# EAGLE design RFM69-ESP-03-v1.0 (EAGLE 7.7.0)
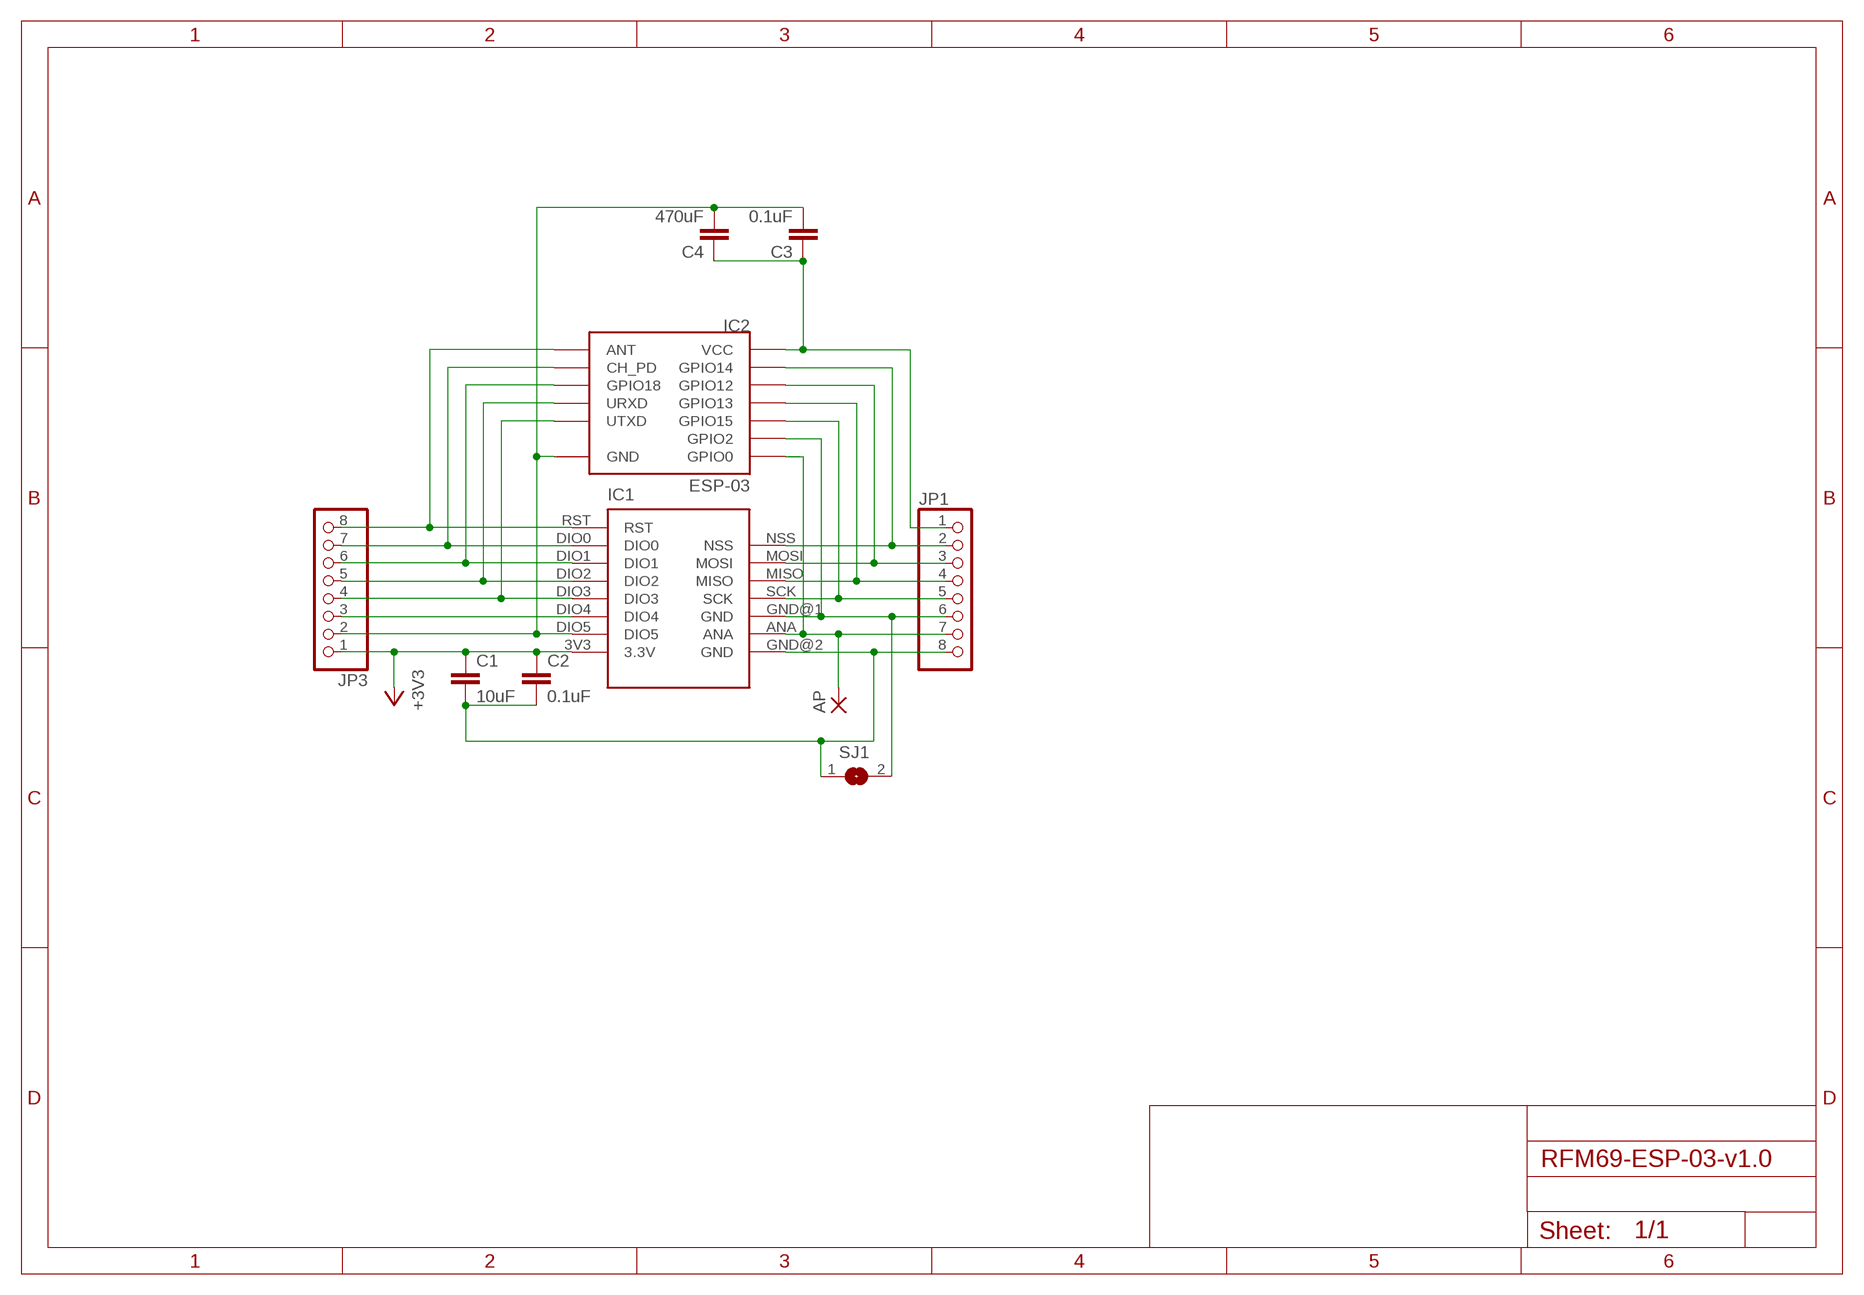
[diagram p0: schematic, sheet 1]

## Parts
AP  SMD5  [SMD2,54-5,08]
C1  10uF  C-EUC1206  [C1206]
C2  0.1uF  C-EUC1206  [C1206]
C3  0.1uF  C-EUC1206  [C1206]
C4  470uF  C-EUC1206  [C1206]
IC1  RFM69HW  [RFM69]
IC2  ESP-03  [ESP-03]
JP1  PINHD-1X8  [1X08]
JP3  PINHD-1X8  [1X08]
SJ1  SJ  [SJ]

## Nets
+3V3: C1.1 C2.1 IC1.3V3(3.3V) JP3.1
N$1: IC1.NSS IC2.GPIO14 JP1.2
N$2: IC1.MOSI IC2.GPIO12 JP1.3
N$3: IC1.MISO IC2.GPIO13 JP1.4
N$4: IC1.SCK IC2.GPIO15 JP1.5
N$5: AP.1(P) IC1.ANA IC2.GPIO0 JP1.7
N$6: C3.1 C4.1 IC2.VCC JP1.1
N$7: IC1.GND@1(GND) IC2.GPIO2 JP1.6 SJ1.2
N$8: IC1.RST IC2.ANT JP3.8
N$9: IC1.DIO0 IC2.CH_PD JP3.7
N$10: IC1.DIO1 IC2.GPIO18 JP3.6
N$11: IC1.DIO2 IC2.URXD JP3.5
N$12: IC1.DIO3 IC2.UTXD JP3.4
N$13: IC1.DIO4 JP3.3
N$15: C1.2 C2.2 IC1.GND@2(GND) JP1.8 SJ1.1
N$16: C3.2 C4.2 IC1.DIO5 IC2.GND JP3.2

## Library data of the parts
AP = wirepad:SMD5: SMD PAD
C1-C4 = rcl:C-EU: CAPACITOR, European symbol
IC1 = kiall:RFM69: RFM69 module
IC2 = kiall:ESP-03: ESP8266 Wifi module ESP-03
JP1 JP3 = pinhead:PINHD-1X8: PIN HEADER
SJ1 = jumper:SJ: SMD solder JUMPER

## Net classes
0 default: width 0.61 mm

## Board
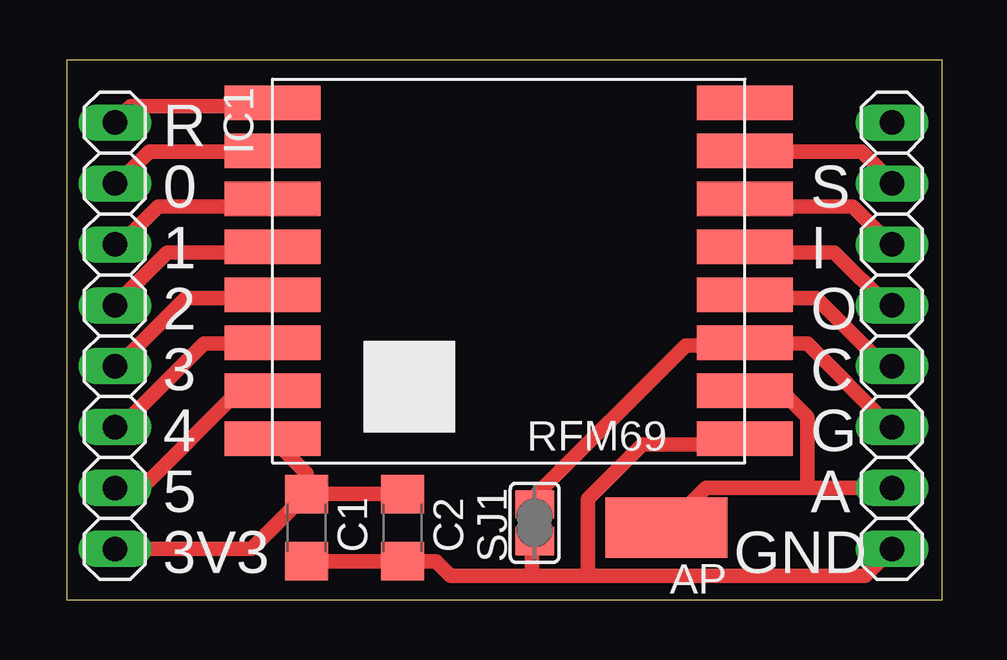
[diagram p1: board, top side]
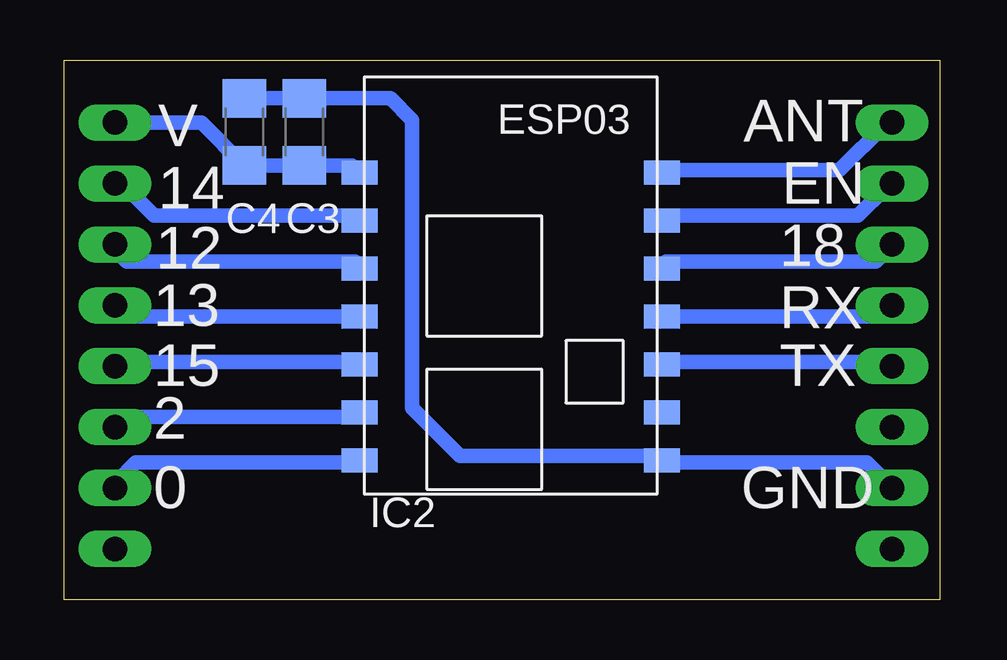
[diagram p2: board, bottom side, seen from below]

Size 36.5 x 22.5 mm. Coordinates in mm from the lower left corner, seen from the top.
Outline: 0,0 36.5,0 36.5,22.5 0,22.5 0,0
Copper layers (1*16): Top 0.035mm / dielectric 1.5mm / Bottom 0.035mm
Design rules "SeeedStudio_2layer_DRU_no_angle_20140221": minimum track width 6mil, minimum drill 12mil, track to track 6mil, track to pad 6mil, pad to pad 6mil, via to via 6mil, smd to smd 0mil, copper to edge 10mil, drill to drill 10mil, minimum pad ring 10mil, minimum via ring 6mil, stop-mask expansion 2mil, vias tented up to drill 100mil, thermal gap 10mil

### Footprints (pad centres in the part's own frame; a part is rotated, then mirrored left to right if it is on the bottom)
SMD2,54-5,08 = smd 2.54 x 5.08: 1 0,0
C1206 = smd 1.6 x 1.8: 1 -1.4,0; 2 1.4,0
RFM69 = smd 4 x 1.44: 3V3 0,1; ANA 19.7,3; DIO0 0,13; DIO1 0,11; DIO2 0,9; DIO3 0,7; DIO4 0,5; DIO5 0,3; GND@1 19.7,5; GND@2 19.7,1; MISO 19.7,9; MOSI 19.7,11; NC 19.7,15; NSS 19.7,13; RST 0,15; SCK 19.7,7
ESP-03 = smd 1.5 x 1: ANT 7.4,4.8; CH_PD 7.4,2.8; GND 7.4,-7.2; GPIO0 -5.2,-7.2; GPIO2 -5.2,-5.2; GPIO12 -5.2,0.8; GPIO13 -5.2,-1.2; GPIO14 -5.2,2.8; GPIO15 -5.2,-3.2; GPIO18 7.4,0.8; NC 7.4,-5.2; URXD 7.4,-1.2; UTXD 7.4,-3.2; VCC -5.2,4.8
1X08 = drill 1.016 long: 1 -8.89,0; 2 -6.35,0; 3 -3.81,0; 4 -1.27,0; 5 1.27,0; 6 3.81,0; 7 6.35,0; 8 8.89,0
SJ = smd 1.168 x 1.6: 1 -0.762,0; 2 0.762,0

### Placement (x,y rotation side)
AP  25,3 90 top
C1  10,3 270 top
C2  14,3 270 top
C3  26.5,19.5 90 bottom
C4  29,19.5 90 bottom
IC1  8.57,5.7 0 top
IC2  19,13 0 bottom
JP1  34.4,11 270 top
JP3  2,11 90 top
SJ1  19.5,3.2 90 top

### Tracks (layer width: path | path; a pad name or v marks a point on that pad's centre or on a via)
+3V3
  Top 0.61: JP3.1 7.71,2.11 C1.1 | C1.1 10,5.27 IC1.3V3 | C2.1 C1.1
N$1
  Top 0.61: IC1.NSS 28.57,18.67 33.15,18.67 34.29,17.53 JP1.2
  Bottom 0.61: IC2.GPIO14 24.38,16 32.77,16 34.29,17.53 JP1.2
N$2
  Top 0.61: IC1.MOSI 28.57,16.38 32.77,16.38 34.29,14.86 JP1.3
  Bottom 0.61: IC2.GPIO12 24.38,14.1 33.91,14.1 34.29,14.48 JP1.3
N$3
  Top 0.61: IC1.MISO 28.57,14.48 32,14.48 34.29,12.19 JP1.4
  Bottom 0.61: IC2.GPIO13 24.38,11.81 33.91,11.81 34.29,12.19 JP1.4
N$4
  Top 0.61: IC1.SCK 28.57,12.57 31.24,12.57 34.29,9.53 JP1.5
  Bottom 0.61: IC2.GPIO15 24.38,9.91 34.29,9.91 JP1.5
N$5
  Top 0.61: JP1.7 30.86,4.65 | 30.86,4.65 30.86,7.62 30.1,8.38 28.57,8.38 IC1.ANA | 30.86,4.65 26.65,4.65 AP.1
  Bottom 0.61: IC2.GPIO0 24.38,5.71 33.53,5.71 34.29,4.95 JP1.7
N$6
  Bottom 0.61: JP1.1 30.79,19.89 C4.1 26.67,18.1 | 26.67,18.1 C3.1 | C3.1 24.5,18.1 IC2.VCC | C3.1 26.67,18.29 26.67,18.1
N$7
  Top 0.61: JP1.6 34.29,7.24 30.86,10.67 28.57,10.67 IC1.GND@1 28.17,10.6 25.8,10.6 19.5,4.3 SJ1.2
  Bottom 0.61: IC2.GPIO2 24.38,7.62 33.91,7.62 34.29,7.24 JP1.6
N$8
  Top 0.61: IC1.RST 8.38,20.57 2.67,20.57 2.29,20.19 JP3.8
  Bottom 0.61: IC2.ANT 11.43,17.91 4.19,17.91 2.29,19.81 JP3.8
N$9
  Top 0.61: IC1.DIO0 8.38,18.67 3.43,18.67 2.29,17.53 JP3.7
  Bottom 0.61: IC2.CH_PD 11.43,16 3.43,16 2.29,17.14 JP3.7
N$10
  Top 0.61: IC1.DIO1 8.38,16.38 3.81,16.38 2.29,14.86 JP3.6
  Bottom 0.61: IC2.GPIO18 11.43,14.1 2.67,14.1 2.29,14.48 JP3.6
N$11
  Top 0.61: IC1.DIO2 8.38,14.48 4.19,14.48 2.29,12.57 JP3.5
  Bottom 0.61: IC2.URXD 11.43,11.81 2.67,11.81 2.29,12.19 JP3.5
N$12
  Top 0.61: IC1.DIO3 8.38,12.57 4.95,12.57 2.29,9.91 JP3.4
  Bottom 0.61: IC2.UTXD 11.43,9.91 2.29,9.91 JP3.4
N$13
  Top 0.61: IC1.DIO4 8.38,10.67 5.71,10.67 2.29,7.24 JP3.3
N$15
  Top 0.61: C1.2 C2.2 15.4,1.6 16,1 19.4,1 | 19.4,1 21.72,1 | 21.72,1 33.29,1 JP1.8 | 21.72,1 21.72,4.19 24,6.48 28.19,6.48 IC1.GND@2 | SJ1.1 19.4,2.44 19.4,1
N$16
  Top 0.61: JP3.2 2.29,4.95 3.43,4.95 6.86,8.38 8.38,8.38 IC1.DIO5
  Bottom 0.61: JP3.2 2.29,4.95 3.05,5.71 11.43,5.71 IC2.GND 11.8,6 20,6 22,8 22,20 22.9,20.9 C3.2 C4.2

### Text on the board
tPlace: R | 0 | S | 1 | I | 2 | O | 3 | C | 4 | G | 5 | A | 3V3 | GND
bPlace: ANT | V | EN | 14 | 18 | 12 | RX | 13 | TX | 15 | 2 | GND | 0